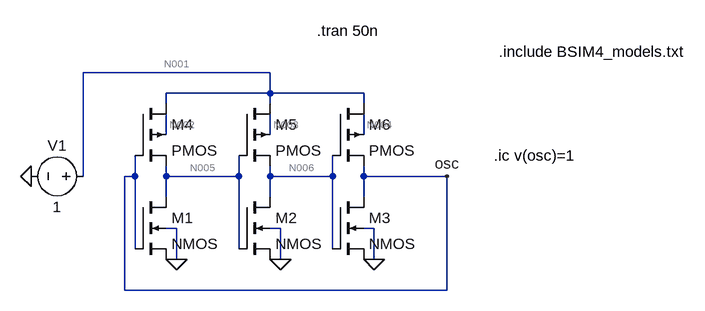
[diagram p0: schematic ring_osc.asc]
ring_osc.asc, the LTspice schematic file:
Version 4.1
SHEET 1 1020 680
WIRE 352 16 64 16
WIRE 352 48 352 16
WIRE 352 48 192 48
WIRE 496 48 352 48
WIRE 192 64 192 48
WIRE 352 64 352 48
WIRE 496 64 496 48
WIRE 192 112 192 80
WIRE 352 112 352 80
WIRE 496 112 496 80
WIRE 64 176 64 16
WIRE 144 176 144 144
WIRE 144 176 128 176
WIRE 192 176 192 160
WIRE 304 176 304 144
WIRE 304 176 192 176
WIRE 352 176 352 160
WIRE 448 176 448 144
WIRE 448 176 352 176
WIRE 496 176 496 160
WIRE 624 176 496 176
WIRE 192 208 192 176
WIRE 352 208 352 176
WIRE 496 208 496 176
WIRE 208 256 192 256
WIRE 368 256 352 256
WIRE 512 256 496 256
WIRE 144 288 144 176
WIRE 304 288 304 176
WIRE 448 288 448 176
WIRE 208 304 208 256
WIRE 208 304 192 304
WIRE 368 304 368 256
WIRE 368 304 352 304
WIRE 512 304 512 256
WIRE 512 304 496 304
WIRE 128 352 128 176
WIRE 624 352 624 176
WIRE 624 352 128 352
FLAG -16 176 0
FLAG 208 304 0
FLAG 368 304 0
FLAG 512 304 0
FLAG 624 176 osc
SYMBOL voltage 80 176 R90
WINDOW 0 -32 56 VBottom 2
WINDOW 3 32 56 VTop 2
WINDOW 123 0 0 Left 0
WINDOW 39 0 0 Left 0
SYMATTR InstName V1
SYMATTR Value 1
SYMBOL nmos4 144 208 R0
SYMATTR InstName M1
SYMBOL nmos4 304 208 R0
SYMATTR InstName M2
SYMBOL nmos4 448 208 R0
SYMATTR InstName M3
SYMBOL pmos4 144 64 R0
SYMATTR InstName M4
SYMBOL pmos4 304 64 R0
SYMATTR InstName M5
SYMBOL pmos4 448 64 R0
SYMATTR InstName M6
TEXT 424 -48 Left 2 !.tran 50n
TEXT 696 144 Left 2 !.ic v(osc)=1
TEXT 704 -16 Left 2 !.include BSIM4_models.txt

The netlist it stands for:
* ring_osc.asc
V1 N001 0 1
M1 N005 osc 0 0 NMOS
M2 N006 N005 0 0 NMOS
M3 osc N006 0 0 NMOS
M4 N001 osc N005 N002 PMOS
M5 N001 N005 N006 N003 PMOS
M6 N001 N006 osc N004 PMOS
.model NMOS NMOS
.model PMOS PMOS
.lib standard.mos
.tran 50n
.ic v(osc)=1
.include BSIM4_models.txt
.backanno
.end

* Results of the author's LTspice run, read from the files saved beside the schematic
* Operating Point, zero values left out:
*   V(n005) = 93.92 nV
*   V(n006) = 1 V
*   V(n002) = 868.3 mV
*   V(n004) = 906.6 mV
*   V(n001) = 1 V
*   V(osc) = 1 V
*   V(n003) = 906.6 mV
*   I(V1) = -6.117 pA
*   Id(M4) = 2.747 pA
*   Is(M4) = -1.878 pA
*   Id(M5) = 2.917 pA
*   Is(M5) = -2.01 pA
*   Id(M2) = 2.01 pA
*   Ib(M2) = -1.01 pA
*   Id(M1) = 1.878 pA
*   Is(M1) = -1.878 pA
*   Id(M3) = 10 µA
*   Is(M3) = -10 µA
*   Ib(M3) = -1.01 pA
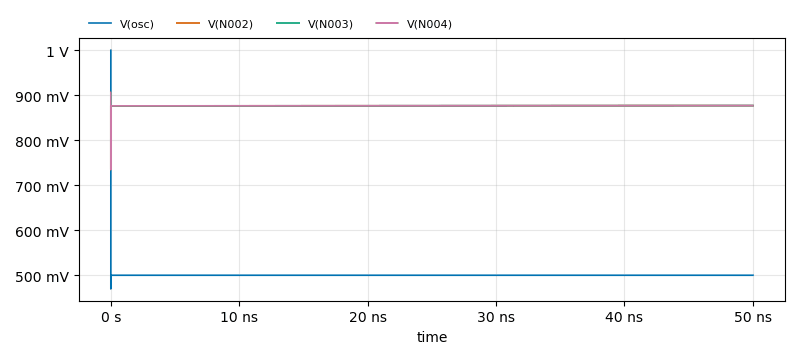
[diagram p1: Transient Analysis of ring_osc.asc, plotted from the saved traces]
* Transient Analysis, 1 run:
*   V(osc): min 469.9 mV, max 1 V, average 500 mV, rms 500 mV, last 500 mV
*   V(N002): min 734.9 mV, max 877.2 mV, average 876.9 mV, rms 876.9 mV, last 877.2 mV
*   V(N003): min 734.9 mV, max 906.6 mV, average 876.9 mV, rms 876.9 mV, last 877.2 mV
*   V(N004): min 735 mV, max 906.6 mV, average 876.9 mV, rms 876.9 mV, last 877.2 mV